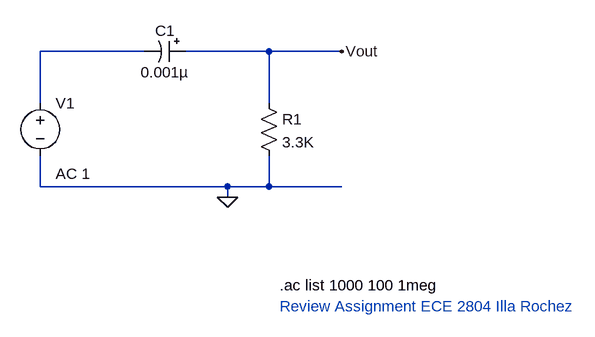
[diagram p0: schematic review_filter_highPass.asc]
review_filter_highPass.asc, the LTspice schematic file:
Version 4
SHEET 1 880 680
WIRE 64 80 -96 80
WIRE 256 80 128 80
WIRE 368 80 256 80
WIRE -96 160 -96 80
WIRE 256 160 256 80
WIRE -96 288 -96 240
WIRE 192 288 -96 288
WIRE 256 288 256 240
WIRE 256 288 192 288
WIRE 368 288 256 288
WIRE 192 304 192 288
FLAG 368 80 Vout
FLAG 192 304 0
SYMBOL res 240 144 R0
SYMATTR InstName R1
SYMATTR Value 3.3K
SYMBOL polcap 128 64 R90
WINDOW 0 0 32 VBottom 2
WINDOW 3 32 32 VTop 2
SYMATTR InstName C1
SYMATTR Value 0.001µ
SYMATTR Description Capacitor
SYMATTR Type cap
SYMATTR SpiceLine V=16 Irms=0 Rser=11 Lser=0
SYMBOL voltage -96 144 R0
WINDOW 123 24 124 Left 2
WINDOW 39 0 0 Left 0
SYMATTR InstName V1
SYMATTR Value ""
SYMATTR Value2 AC 1
TEXT 272 472 Left 2 ;Review Assignment ECE 2804 Illa Rochez
TEXT 272 440 Left 2 !.ac list 1000 100 1meg

The netlist it stands for:
* review_filter_highPass.asc
R1 Vout 0 3.3K
C1 Vout N001 0.001µ V=16 Irms=0 Rser=11 Lser=0
V1 N001 0 AC 1
* Review Assignment ECE 2804 Illa Rochez
.ac list 1000 100 1meg
.backanno
.end

* Results of the author's LTspice run, read from the files saved beside the schematic
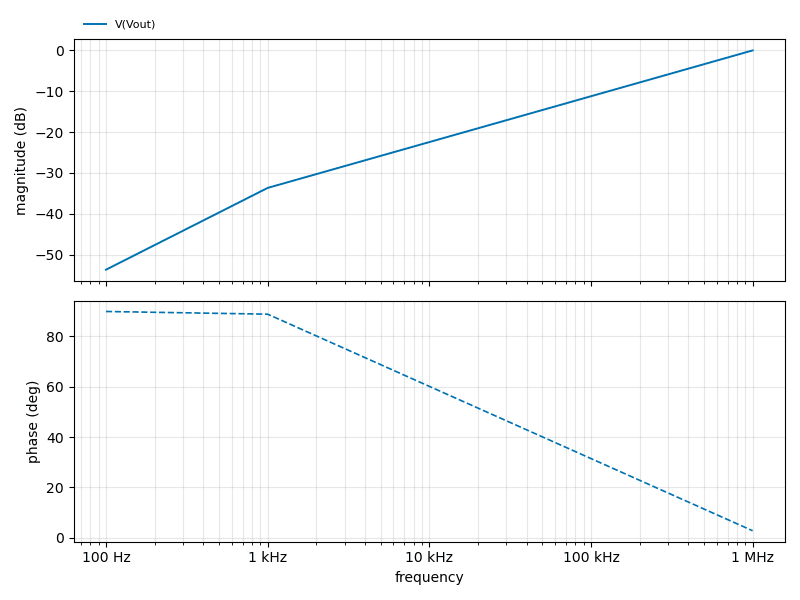
[diagram p1: AC Analysis of review_filter_highPass.asc, plotted from the saved traces]
* AC Analysis, 1 run:
*   V(Vout): -53.67 dB at 100 Hz, -0.04 dB at 1 MHz, peak -0.04 dB at 1 MHz, 3 dB below the peak at 538.8 kHz